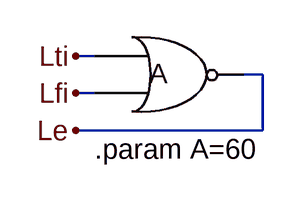
[diagram p0: schematic WCHBSink.asc]
WCHBSink.asc, the LTspice schematic file:
Version 4
SHEET 1 3196 952
WIRE 1696 144 1680 144
WIRE 1840 160 1824 160
WIRE 1696 176 1680 176
WIRE 1840 208 1840 160
WIRE 1840 208 1680 208
FLAG 1680 144 Lti
FLAG 1680 176 Lfi
FLAG 1680 208 Le
SYMBOL nor 1760 160 R0
WINDOW 0 -17 -1 Left 2
SYMATTR InstName A
SYMATTR SpiceLine W={A}
TEXT 1696 224 Left 2 !.param A=60

The netlist it stands for:
* WCHBSink.asc
XA Lti Lfi Le nor W={A}  ; pins A B OUT
.param A=60
.backanno
.end